# Altium schematic sheet 11.MICROSD.SchDoc: MICRO-SD
size A; SheetNumber: 11; SheetTotal: 16
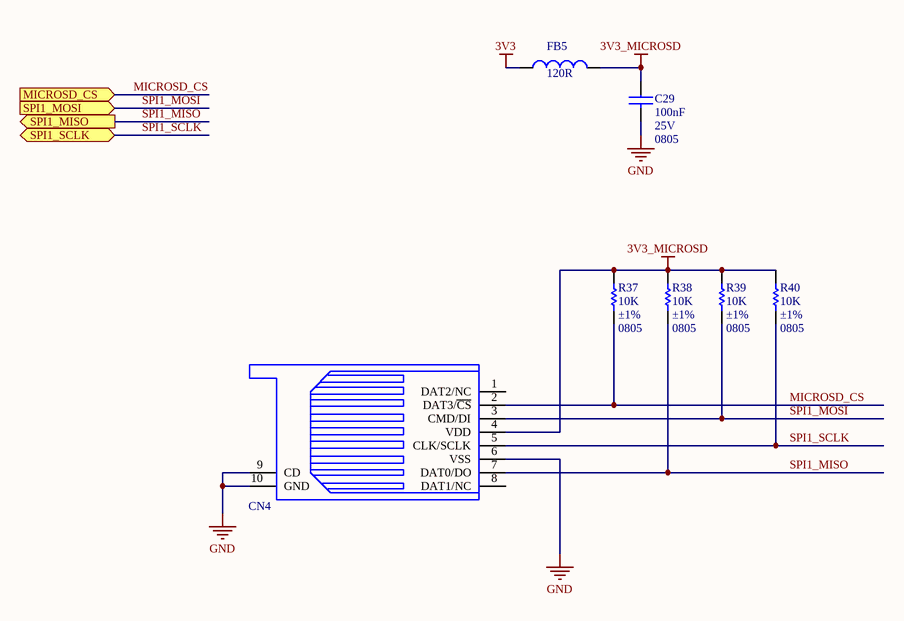
[diagram p0: 11.MICROSD.SchDoc]

## Parts
C29  Capacitance: 100nF  Voltage - Rated: 25V  Package / Case: 0805  [CAPC2012X100N_EIA0805]  (hidden comment: CAP_NP)
CN4  MICRO-SD  [MOLEX_0472192001]  (value not drawn)
FB5  Impedance: 120R  [FILC2012X100N_EIA0805]  (hidden comment: BEAD)
R37  value 10K  Tolerance: ±1%  Package / Case: 0805  [RESC2013X65N_EIA0805]  (hidden comment: RES)
R38  value 10K  Tolerance: ±1%  Package / Case: 0805  [RESC2013X65N_EIA0805]  (hidden comment: RES)
R39  value 10K  Tolerance: ±1%  Package / Case: 0805  [RESC2013X65N_EIA0805]  (hidden comment: RES)
R40  value 10K  Tolerance: ±1%  Package / Case: 0805  [RESC2013X65N_EIA0805]  (hidden comment: RES)

## Ports
MICROSD_CS (in), SPI1_MISO (out), SPI1_MOSI (in), SPI1_SCLK (bidir)

## Nets
3V3: FB5.1
3V3_MICROSD: C29.1 CN4.4(VDD) FB5.2 R37.1 R38.1 R39.1 R40.1
GND: C29.2 CN4.6(VSS) CN4.9(CD) CN4.10(GND)
MICROSD_CS: CN4.2(DAT3/~{CS}) R37.2 ; port MICROSD_CS
SPI1_MISO: CN4.7(DAT0/DO) R38.2 ; port SPI1_MISO
SPI1_MOSI: CN4.3(CMD/DI) R39.2 ; port SPI1_MOSI
SPI1_SCLK: CN4.5(CLK/SCLK) R40.2 ; port SPI1_SCLK

Not connected (* = marked no-connect by the designer): CN4 1(DAT2/NC) 8(DAT1/NC)

## Library data of the parts
C29 = SCAP00300093: CAP CER 0.1UF 25V X7R 0805; Manufacturer: Samsung Electro-Mechanics America, Inc.; Manufacturer Part Number: CL21B104KACNNNC; Value: 100nF; Tolerance: ±10%; Type: Multi Layer Ceramic Capacitor  (MLCC); Cost x1 ($): 0.10000; Cost x10 ($): 0.03300; Cost x100 ($): 0.01470; Cost x1000 ($): 0.00825; Distrubutor: Digikey; Lead Time: 11 Weeks; Part Number: SCAP00300093; Temperature Coefficient: X7R; Operating Temperature: -55°C ~ 125°C; Mounting Type: Surface Mount, MLCC; Size / Dimension: 0.079" L x 0.049" W (2.00mm x 1.25mm); Category: Capacitors; Family: Ceramic Capacitors; Distributor Part Number: 1276-1099-1-ND; Distributor Link: http://www.digikey.com/product-detail/en/samsung-electro-mechanics-america-inc/CL21B104KACNNNC/1276-1099-1-ND/3889185; ROHS: YES; Moisture Sensitivity Level (MSL): 1 (Unlimited); Quantity: 50
CN4 = SCON00095: CONN MICRO SD CARD HINGED TYPE; Manufacturer: Molex, LLC; Manufacturer Part Number: 0472192001; Connector Type: Connector and Ejector; Cost x1 ($): 1.11000; Cost x10 ($): 0.97300; Cost x100 ($): 0.83950; Cost x1000 ($): 0.76320; Distrubutor: Digikey; Lead Time: 10 Weeks; Part Number: SCON00095; Value: MICRO-SD; Category: Connectors, Interconnects; Family: Memory Connectors - PC Cards - Secure Digital - microSD™; Contact Type: Secure Digital - microSD™; Mounting Type: Normal, Standard - Top; Distributor Part Number: WM6698CT-ND; Datasheet Link: http://www.digikey.com/product-detail/en/0472192001/WM6698CT-ND/3044147; ROHS: YES; Moisture Sensitivity Level (MSL): 1 (Unlimited); Part Status: Active; Quantity: 20
FB5 = SFIL00005: FERRITE CHIP POWER 120 OHM SMD; Manufacturer: Laird-Signal Integrity Products; Manufacturer Part Number: HI0805O121R-10; Type: Differential Mode - Single; Current Rating: 3.5A; DC Resistance (DCR): 20 mOhm Max; Cost x10 ($): 0.08700; Cost x100 ($): 0.05230; Cost x1000 ($): 0.03010; Distrubutor: Digikey; Cost x1 ($): 0.10000; Part Number: SFIL00005; Package / Case: 0805 (2012 Metric); Value: BEAD; Category: Filters; Family: Ferrite Beads and Chips; Distributor Part Number: 240-2393-1-ND; ROHS: YES; Datasheet Link: http://www.digikey.com/product-detail/en/HI0805O121R-10/240-2393-1-ND/806753; Quantity: 50
R37-R40 = SRES03010098: RES SMD 10K OHM 1% 1/8W 0805; Manufacturer: Yageo; Manufacturer Part Number: RC0805FR-0710KL; Power (Watts): 0.125W, 1/8W; Cost x1 ($): 0.10; Cost x10 ($): 0.21; Cost x100 ($): 0.84; Cost x1000 ($): 3.79; Distrubutor: Digikey; Part Number: SRES03010098; Resistance (Ohm): 10K; Category: Resistors; Family: Chip Resistor - Surface Mount; Distributor Part Number: 311-10.0KCRCT-ND; Distributor Link: http://www.digikey.com/product-detail/en/RC0805FR-0710KL/311-10.0KCRCT-ND/730482; ROHS: YES; Quantity: 0